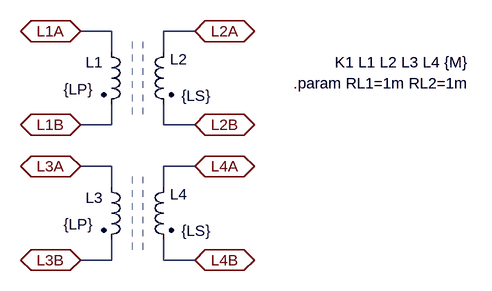
[diagram p0: schematic Trafo.asc]
Trafo.asc, the LTspice schematic file:
Version 4
SHEET 1 880 680
WIRE 272 112 224 112
WIRE 400 112 352 112
WIRE 272 144 272 112
WIRE 352 144 352 112
WIRE 272 256 272 224
WIRE 272 256 224 256
WIRE 352 256 352 224
WIRE 400 256 352 256
WIRE 272 320 224 320
WIRE 400 320 352 320
WIRE 272 352 272 320
WIRE 352 352 352 320
WIRE 272 464 272 432
WIRE 272 464 224 464
WIRE 352 464 352 432
WIRE 400 464 352 464
FLAG 224 112 L1A
IOPIN 224 112 BiDir
FLAG 224 256 L1B
IOPIN 224 256 BiDir
FLAG 400 112 L2A
IOPIN 400 112 BiDir
FLAG 400 256 L2B
IOPIN 400 256 BiDir
FLAG 224 320 L3A
IOPIN 224 320 BiDir
FLAG 224 464 L3B
IOPIN 224 464 BiDir
FLAG 400 320 L4A
IOPIN 400 320 BiDir
FLAG 400 464 L4B
IOPIN 400 464 BiDir
SYMBOL ind2 256 128 R0
WINDOW 0 -24 32 Left 2
WINDOW 3 -58 73 Left 2
SYMATTR InstName L1
SYMATTR Value {LP}
SYMATTR Type ind
SYMATTR SpiceLine Rser={RP}
SYMBOL ind2 368 128 M0
WINDOW 0 -21 27 Left 2
WINDOW 3 -57 83 Left 2
SYMATTR InstName L2
SYMATTR Value {LS}
SYMATTR Type ind
SYMATTR SpiceLine Rser={RS}
SYMBOL ind2 256 336 R0
WINDOW 0 -24 32 Left 2
WINDOW 3 -58 73 Left 2
SYMATTR InstName L3
SYMATTR Value {LP}
SYMATTR Type ind
SYMATTR SpiceLine Rser={RP}
SYMBOL ind2 368 336 M0
WINDOW 0 -21 27 Left 2
WINDOW 3 -57 83 Left 2
SYMATTR InstName L4
SYMATTR Value {LS}
SYMATTR Type ind
SYMATTR SpiceLine Rser={RS}
TEXT 616 160 Left 2 !K1 L1 L2 L3 L4 {M}
TEXT 552 192 Left 2 !.param RL1=1m RL2=1m
LINE Normal 304 240 304 128 2
LINE Normal 320 240 320 128 2
LINE Normal 304 448 304 336 2
LINE Normal 320 448 320 336 2

The netlist it stands for:
* Trafo.asc
L1 L1A L1B {LP} Rser={RP}
L2 L2A L2B {LS} Rser={RS}
L3 L3A L3B {LP} Rser={RP}
L4 L4A L4B {LS} Rser={RS}
K1 L1 L2 L3 L4 {M}
.param RL1=1m RL2=1m
.backanno
.end